# EAGLE board PolyDAC2 (EAGLE 5.11)
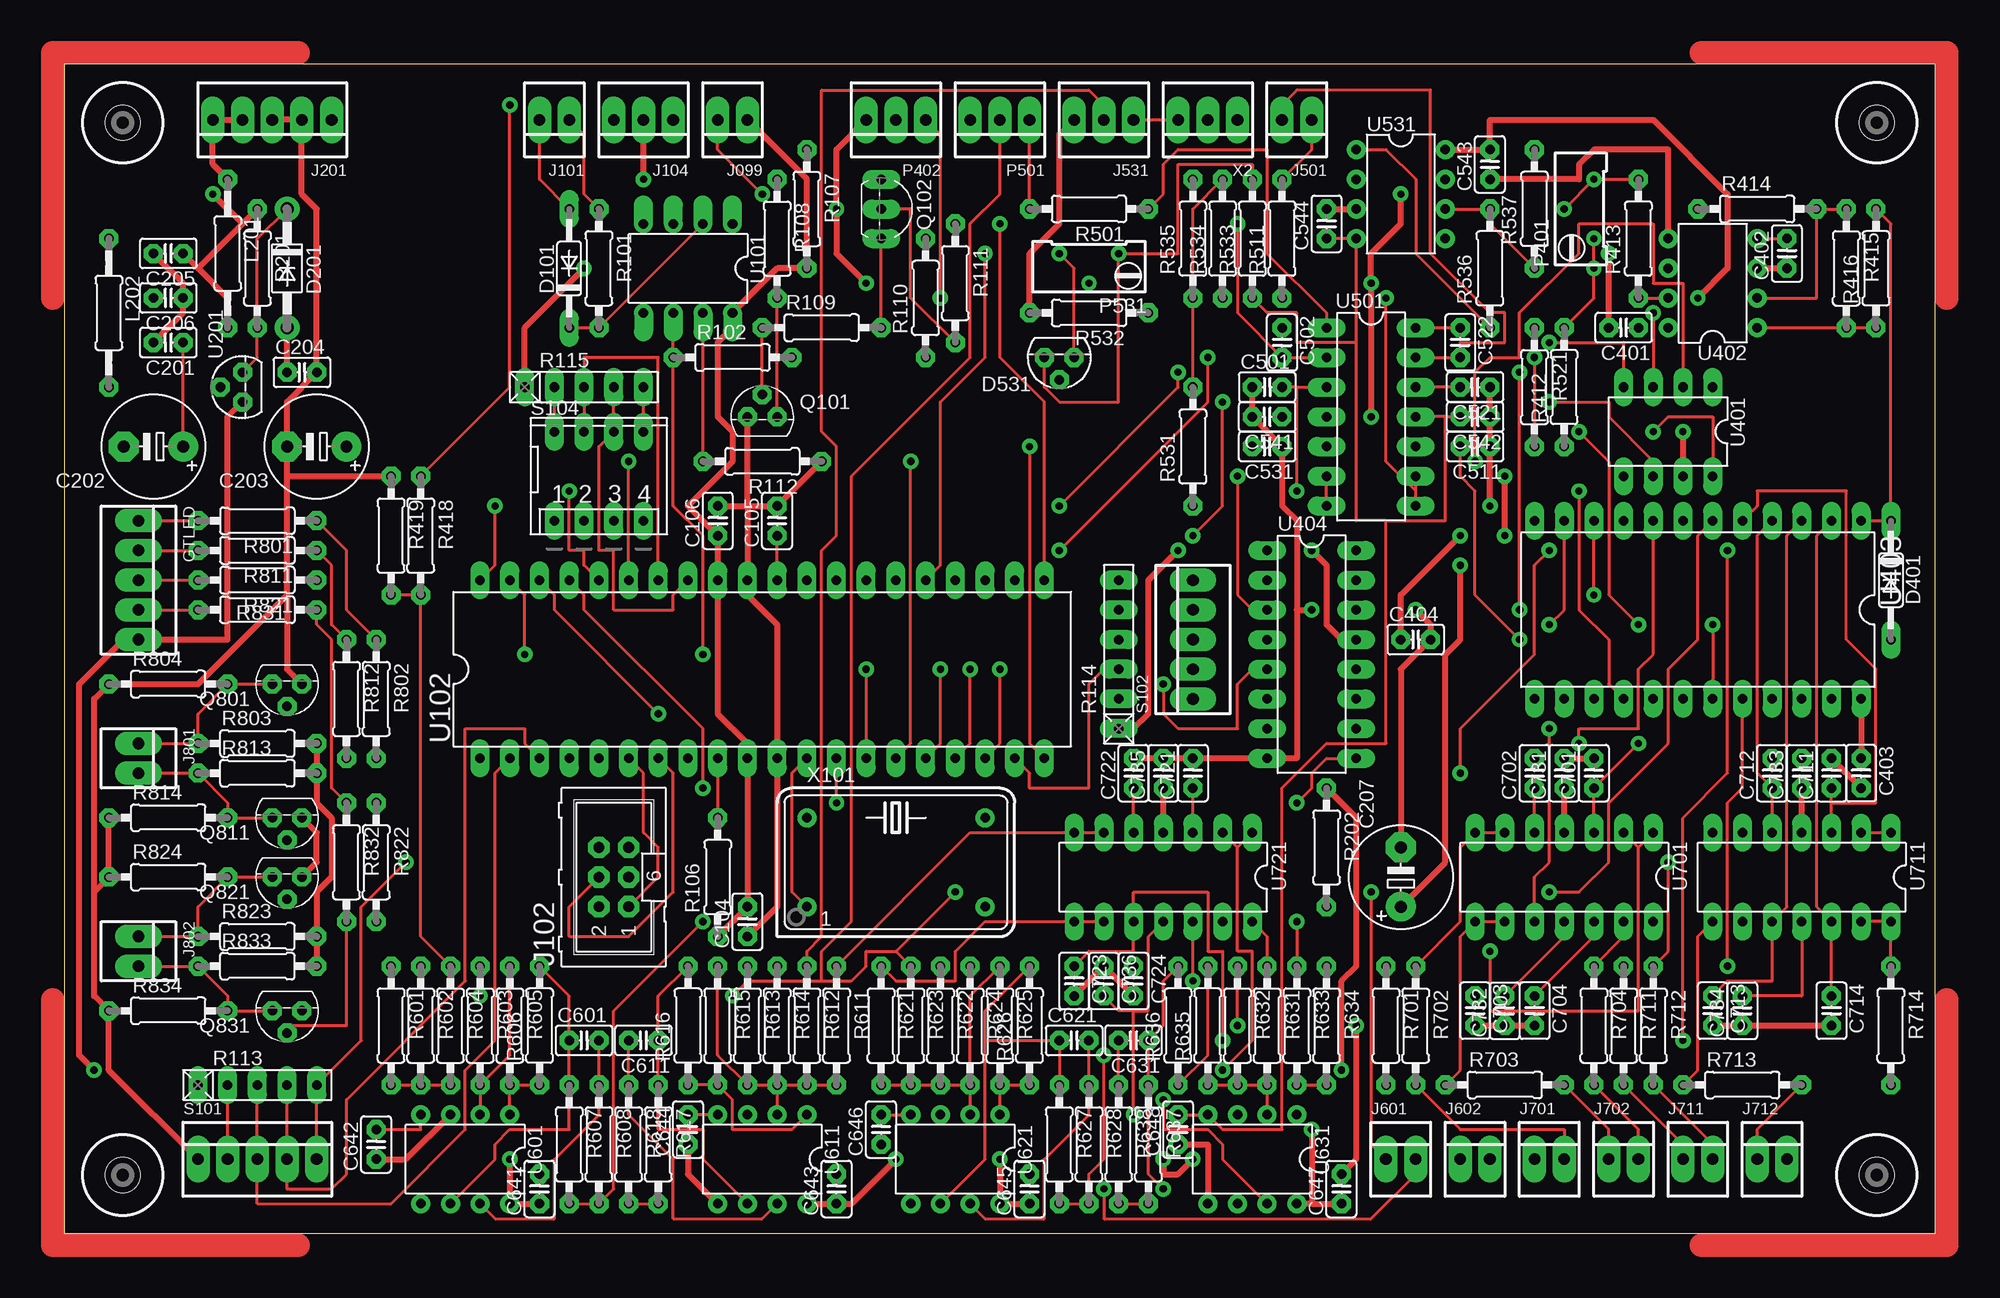
[diagram p8: board, top side]
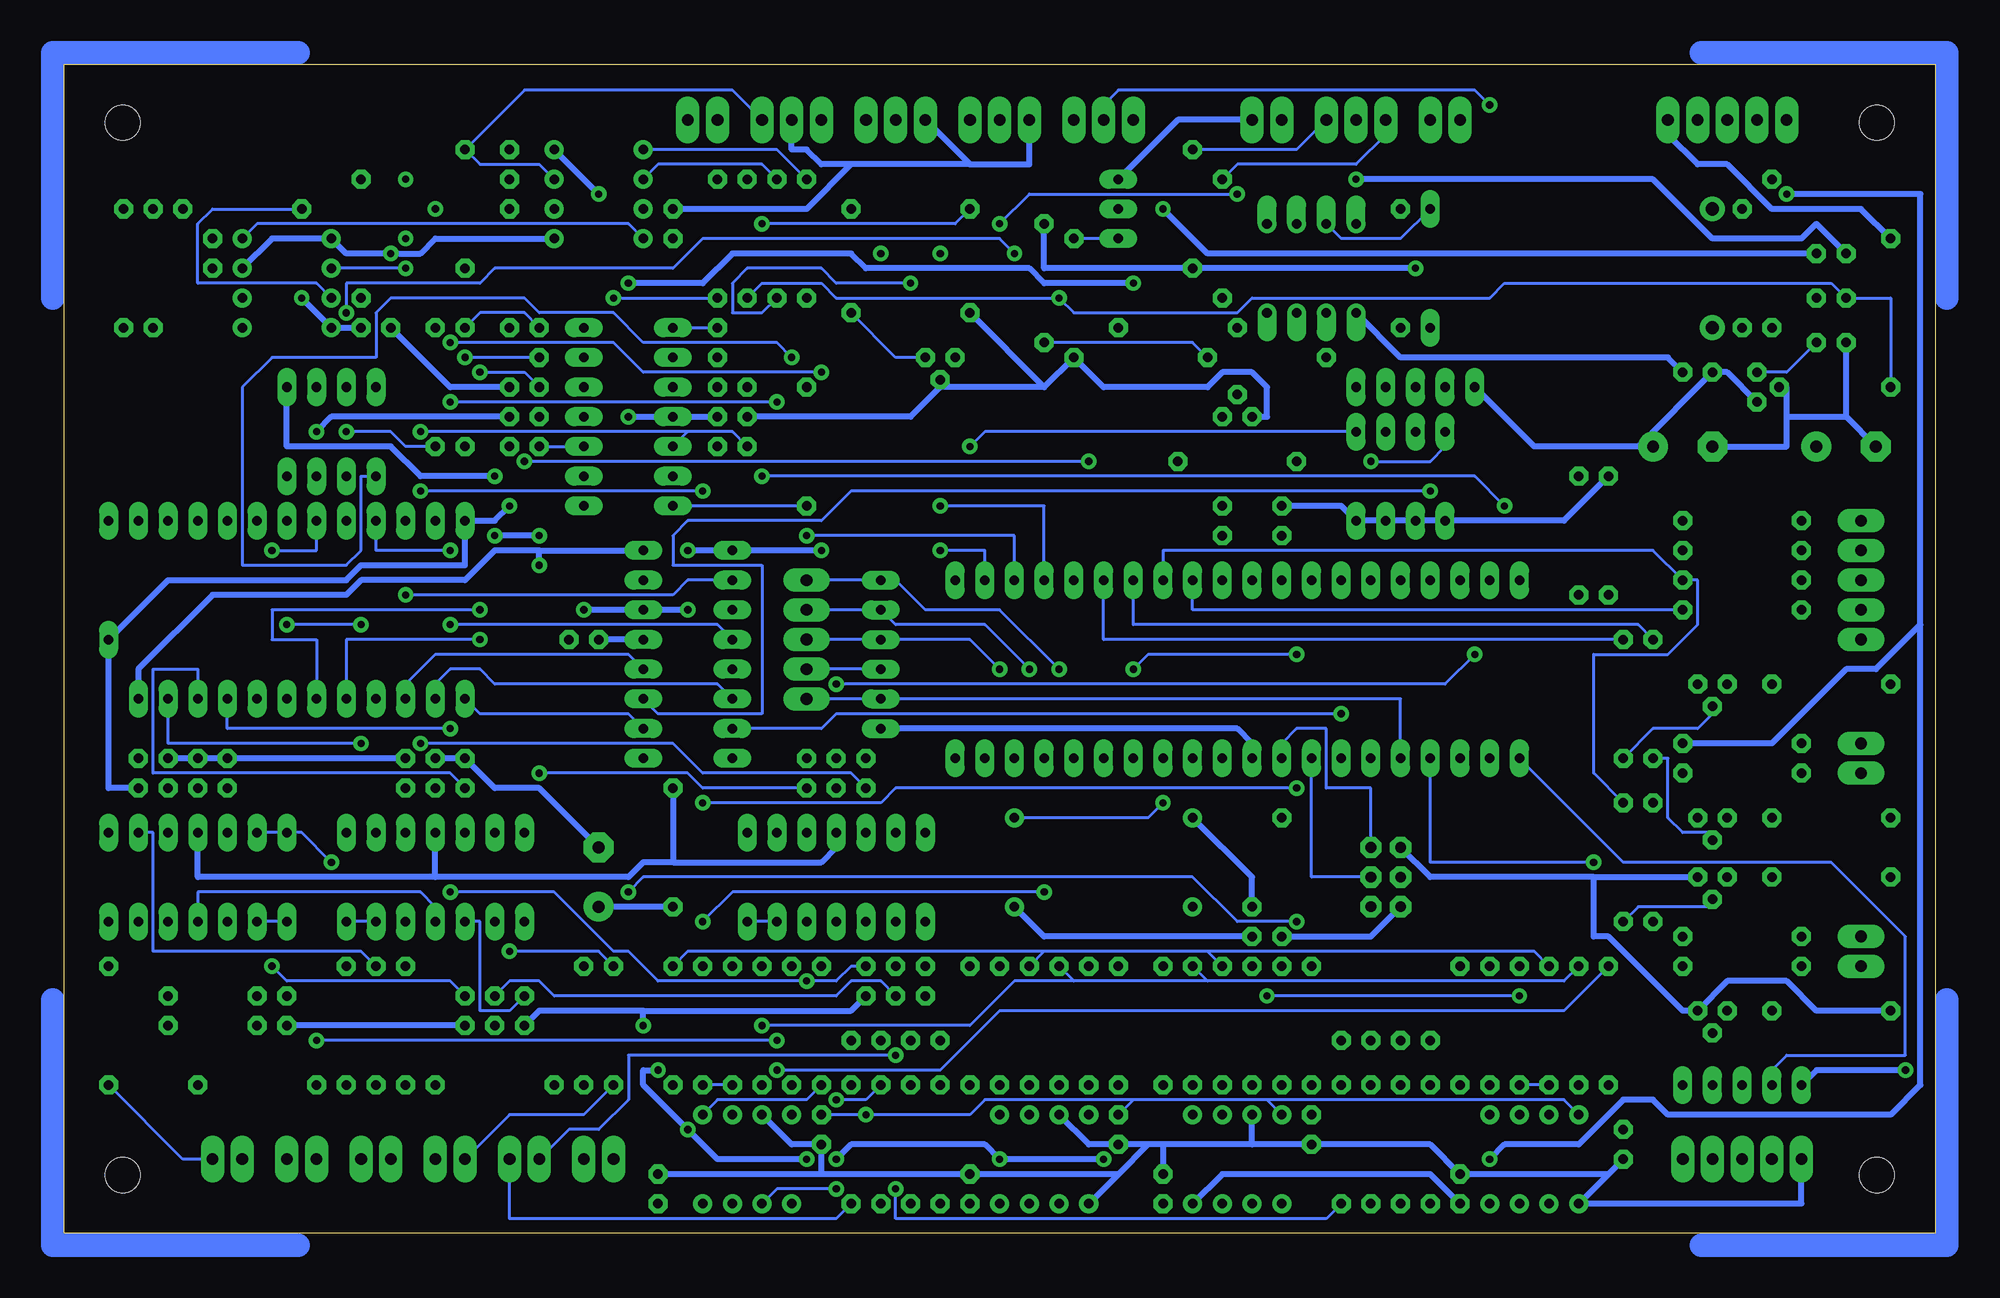
[diagram p9: board, bottom side, seen from below]

Size 160 x 100 mm. Coordinates in mm from the lower left corner, seen from the top.
Outline: 0,0 160,0 160,100 0,100 0,0
Copper layers (1*16): Top 0.035mm / dielectric 1.5mm / Bottom 0.035mm
Design rules "default *": minimum track width 10mil, minimum drill 24mil, track to track 12mil, track to pad 12mil, pad to pad 12mil, via to via 12mil, smd to smd 8mil, copper to edge 40mil, drill to drill 8mil, minimum pad ring 14mil, minimum via ring 14mil, stop-mask expansion 4mil, vias tented up to drill 0mil, thermal gap 10mil
Net classes: 1 bold: width 0.508 mm

## Footprints (pad centres in the part's own frame; a part is rotated, then mirrored left to right if it is on the bottom)
C025-025X050 = drill 0.813 octagon: 1 -1.27,0; 2 1.27,0
E5-8,5 = drill 1.016 pad 2.54 round: + -2.54,0 | drill 1.016 pad 2.54 octagon: - 2.54,0
DO35-10 = drill 0.813 long: A 5.08,0; C -5.08,0
DO41-10 = drill 1.118 round: A 5.08,0; C -5.08,0
TO92 = drill 0.813 octagon: 1 -1.27,0; 2 0,1.905; 3 1.27,0
22-23-2051 = drill 1 long: 1 -5.08,0; 2 -2.54,0; 3 0,0; 4 2.54,0; 5 5.08,0
22-23-2021 = drill 1 long: 1 -1.27,0; 2 1.27,0
ML6 = drill 0.914 octagon: 1 -2.54,-1.27; 2 -2.54,1.27; 3 0,-1.27; 4 0,1.27; 5 2.54,-1.27; 6 2.54,1.27
22-23-2031 = drill 1 long: 1 -2.54,0; 2 0,0; 3 2.54,0
0207/12 = drill 0.813 octagon: 1 -6.35,0; 2 6.35,0
RTRIM64Y = drill 0.61 round: 1 0,-2.54; 2 -2.54,0; 3 0,2.54
TO92' = drill 0.813 octagon: 1 1.27,0; 2 0,1.905; 3 -1.27,0
TO92-EBC = drill 0.813 long: B 0,-1.27; C 2.54,-1.27; E -2.54,-1.27
0207/10 = drill 0.813 octagon: 1 -5.08,0; 2 5.08,0
RN-5 = drill 0.813 long: 1 -5.08,0; 2 -2.54,0; 3 0,0; 4 2.54,0; 5 5.08,0
RN-6 = drill 0.813 long: 1 -6.35,0; 2 -3.81,0; 3 -1.27,0; 4 1.27,0; 5 3.81,0; 6 6.35,0
DP-04 = drill 0.813 long: 1 -3.81,-3.81; 2 -1.27,-3.81; 3 1.27,-3.81; 4 3.81,-3.81; 5 3.81,3.81; 6 1.27,3.81; 7 -1.27,3.81; 8 -3.81,3.81
DIL08 = drill 0.813 offset: 1 -3.81,-3.81; 2 -1.27,-3.81; 3 1.27,-3.81; 4 3.81,-3.81; 5 3.81,3.81; 6 1.27,3.81; 7 -1.27,3.81; 8 -3.81,3.81
DIL40 = drill 0.813 long: 1 -24.13,-7.62; 2 -21.59,-7.62; 3 -19.05,-7.62; 4 -16.51,-7.62; 5 -13.97,-7.62; 6 -11.43,-7.62; 7 -8.89,-7.62; 8 -6.35,-7.62; 9 -3.81,-7.62; 10 -1.27,-7.62; 11 1.27,-7.62; 12 3.81,-7.62; 13 6.35,-7.62; 14 8.89,-7.62; 15 11.43,-7.62; 16 13.97,-7.62; 17 16.51,-7.62; 18 19.05,-7.62; 19 21.59,-7.62; 20 24.13,-7.62; 21 24.13,7.62; 22 21.59,7.62; 23 19.05,7.62; 24 16.51,7.62; 25 13.97,7.62; 26 11.43,7.62; 27 8.89,7.62; 28 6.35,7.62; 29 3.81,7.62; 30 1.27,7.62; 31 -1.27,7.62; 32 -3.81,7.62; 33 -6.35,7.62; 34 -8.89,7.62; 35 -11.43,7.62; 36 -13.97,7.62; 37 -16.51,7.62; 38 -19.05,7.62; 39 -21.59,7.62; 40 -24.13,7.62
DIL08' = drill 0.813 long: 1 -3.81,-3.81; 2 -1.27,-3.81; 3 1.27,-3.81; 4 3.81,-3.81; 5 3.81,3.81; 6 1.27,3.81; 7 -1.27,3.81; 8 -3.81,3.81
DIL08'' = drill 0.813 pad 1.27 round: 1 -3.81,-3.81; 2 -1.27,-3.81; 3 1.27,-3.81; 4 3.81,-3.81; 5 3.81,3.81; 6 1.27,3.81; 7 -1.27,3.81; 8 -3.81,3.81
DIL24-6 = drill 0.813 long: 1 -13.97,-7.62; 2 -11.43,-7.62; 3 -8.89,-7.62; 4 -6.35,-7.62; 5 -3.81,-7.62; 6 -1.27,-7.62; 7 1.27,-7.62; 8 3.81,-7.62; 9 6.35,-7.62; 10 8.89,-7.62; 11 11.43,-7.62; 12 13.97,-7.62; 13 13.97,7.62; 14 11.43,7.62; 15 8.89,7.62; 16 6.35,7.62; 17 3.81,7.62; 18 1.27,7.62; 19 -1.27,7.62; 20 -3.81,7.62; 21 -6.35,7.62; 22 -8.89,7.62; 23 -11.43,7.62; 24 -13.97,7.62
DIL16 = drill 0.813 long: 1 -8.89,-3.81; 2 -6.35,-3.81; 3 -3.81,-3.81; 4 -1.27,-3.81; 5 1.27,-3.81; 6 3.81,-3.81; 7 6.35,-3.81; 8 8.89,-3.81; 9 8.89,3.81; 10 6.35,3.81; 11 3.81,3.81; 12 1.27,3.81; 13 -1.27,3.81; 14 -3.81,3.81; 15 -6.35,3.81; 16 -8.89,3.81
DIL14 = drill 0.813 long: 1 -7.62,-3.81; 2 -5.08,-3.81; 3 -2.54,-3.81; 4 0,-3.81; 5 2.54,-3.81; 6 5.08,-3.81; 7 7.62,-3.81; 8 7.62,3.81; 9 5.08,3.81; 10 2.54,3.81; 11 0,3.81; 12 -2.54,3.81; 13 -5.08,3.81; 14 -7.62,3.81
DRIL-3 = hole 3: 0,0
DIL14S = drill 0.813 round: 1 -7.62,-3.81; 7 7.62,-3.81; 8 7.62,3.81; 14 -7.62,3.81

## Placement (x,y rotation side)
C104  100nF  [C025-025X050]  58.42,26.67 90 top
C105  100nF  [C025-025X050]  60.96,60.96 90 top
C106  100nF  [C025-025X050]  55.88,60.96 90 top
C201  100nF  [C025-025X050]  8.89,76.2 180 top
C202  22µ 25V  [E5-8,5]  7.62,67.31 180 top
C203  22µ 25V  [E5-8,5]  21.59,67.31 180 top
C204  100nF  [C025-025X050]  20.32,73.66 0 top
C205  100nF  [C025-025X050]  8.89,83.82 180 top
C206  100nF  [C025-025X050]  8.89,80.01 180 top
C207  22µ 25V  [E5-8,5]  114.3,30.48 90 top
C401  100nF  [C025-025X050]  133.35,77.47 180 top
C402  100nF  [C025-025X050]  147.32,83.82 90 top
C403  100nF  [C025-025X050]  153.67,39.37 270 top
C404  100nF  [C025-025X050]  115.57,50.8 0 top
C501  10nF  [C025-025X050]  102.87,72.39 0 top
C502  33pF  [C025-025X050]  104.14,76.2 270 top
C511  10nF  [C025-025X050]  120.65,67.31 180 top
C521  10nF  [C025-025X050]  120.65,72.39 180 top
C522  33pF  [C025-025X050]  119.38,76.2 270 top
C531  10nF  [C025-025X050]  102.87,67.31 180 top
C541  100nF  [C025-025X050]  102.87,69.85 180 top
C542  100nF  [C025-025X050]  120.65,69.85 180 top
C543  100nF  [C025-025X050]  121.92,91.44 90 top
C544  100nF  [C025-025X050]  107.95,86.36 90 top
C601  33pF  [C025-025X050]  44.45,16.51 0 top
C611  33pF  [C025-025X050]  49.53,16.51 180 top
C621  33pF  [C025-025X050]  86.36,16.51 0 top
C631  33pF  [C025-025X050]  91.44,16.51 180 top
C641  100nF  [C025-025X050]  40.64,3.81 90 top
C642  100nF  [C025-025X050]  26.67,7.62 90 top
C643  100nF  [C025-025X050]  66.04,3.81 90 top
C644  100nF  [C025-025X050]  53.34,8.89 90 top
C645  100nF  [C025-025X050]  82.55,3.81 90 top
C646  100nF  [C025-025X050]  69.85,8.89 90 top
C647  100nF  [C025-025X050]  109.22,3.81 90 top
C648  100nF  [C025-025X050]  95.25,8.89 90 top
C701  10nF  [C025-025X050]  130.81,39.37 90 top
C702  10nF  [C025-025X050]  125.73,39.37 90 top
C703  10nF  [C025-025X050]  120.65,19.05 270 top
C704  10nF  [C025-025X050]  125.73,19.05 270 top
C711  10nF  [C025-025X050]  151.13,39.37 90 top
C712  10nF  [C025-025X050]  146.05,39.37 90 top
C713  10nF  [C025-025X050]  140.97,19.05 270 top
C714  10nF  [C025-025X050]  151.13,19.05 270 top
C721  10nF  [C025-025X050]  96.52,39.37 90 top
C722  10nF  [C025-025X050]  91.44,39.37 90 top
C723  10nF  [C025-025X050]  86.36,21.59 270 top
C724  10nF  [C025-025X050]  91.44,21.59 270 top
C731  100nF  [C025-025X050]  128.27,39.37 90 top
C732  100nF  [C025-025X050]  123.19,19.05 90 top
C733  100nF  [C025-025X050]  148.59,39.37 90 top
C734  100nF  [C025-025X050]  143.51,19.05 90 top
C735  100nF  [C025-025X050]  93.98,39.37 90 top
C736  100nF  [C025-025X050]  88.9,21.59 270 top
D101  1N4148  [DO35-10]  43.18,82.55 90 top
D201  1N4004  [DO41-10]  19.05,82.55 270 top
D401  BAT42  [DO35-10]  156.21,55.88 270 top
D531  LM336LP  [TO92]  85.09,74.93 180 top
GTLED  GATELED  [22-23-2051]  6.35,55.88 270 top
J099  MIDI-LED  [22-23-2021]  57.15,95.25 180 top
J101  MIDI-IN  [22-23-2021]  41.91,95.25 180 top
J102  ISP  [ML6]  46.99,30.48 90 top
J104  MIDI-THRU  [22-23-2031]  49.53,95.25 180 top
J201  POWER IN  [22-23-2051]  17.78,95.25 180 top
J501  SUSTAIN AFTERTOUCH  [22-23-2021]  105.41,95.25 180 top
J531  PITCH CV  [22-23-2031]  88.9,95.25 180 top
J601  NOTE 0/1  [22-23-2021]  114.3,6.35 0 top
J602  NOTE 2/3  [22-23-2021]  120.65,6.35 0 top
J701  CC 1/2  [22-23-2021]  127,6.35 0 top
J702  CC 3/4  [22-23-2021]  133.35,6.35 0 top
J711  VELO 0/1  [22-23-2021]  139.7,6.35 0 top
J712  VELO 3/4  [22-23-2021]  146.05,6.35 0 top
J801  GATE 1/2  [22-23-2021]  6.35,40.64 270 top
J802  GATE 3/4  [22-23-2021]  6.35,24.13 270 top
L201  1mH  [0207/12]  13.97,83.82 270 top
L202  1mH  [0207/12]  3.81,78.74 270 top
P401  2K 25T  [RTRIM64Y]  130.81,87.63 0 top
P402  TUNE  [22-23-2031]  71.12,95.25 180 top
P501  MODWHEEL/PITCH  [22-23-2031]  80.01,95.25 180 top
P531  10K 25T  [RTRIM64Y]  87.63,83.82 90 top
Q101  2N3904  [TO92']  59.69,69.85 0 top
Q102  2N3906  [TO92-EBC]  71.12,87.63 270 top
Q801  2N3904  [TO92']  19.05,46.99 180 top
Q811  2N3904  [TO92']  19.05,35.56 180 top
Q821  2N3904  [TO92']  19.05,30.48 180 top
Q831  2N3904  [TO92']  19.05,19.05 180 top
R101  220R  [0207/10]  45.72,82.55 270 top
R102  1K5  [0207/10]  57.15,74.93 0 top
R106  10K  [0207/10]  55.88,30.48 90 top
R107  220R  [0207/10]  63.5,87.63 270 top
R108  220R  [0207/10]  60.96,85.09 270 top
R109  4K7  [0207/10]  64.77,77.47 0 top
R110  33K  [0207/10]  73.66,80.01 90 top
R111  220R  [0207/10]  76.2,81.28 270 top
R112  15K  [0207/10]  59.69,66.04 180 top
R113  4x 1K  [RN-5]  16.51,12.7 0 top
R114  5 x 1K  [RN-6]  90.17,49.53 90 top
R115  4 x 1K  [RN-5]  44.45,72.39 0 top
R201  56R  [0207/10]  16.51,82.55 270 top
R202  100R  [0207/10]  107.95,33.02 270 top
R412  4K7  [0207/10]  128.27,72.39 90 top
R413  11K5  [0207/10]  134.62,85.09 90 top
R414  11K  [0207/10]  144.78,87.63 0 top
R415  22K  [0207/10]  152.4,82.55 270 top
R416  10R  [0207/10]  154.94,82.55 90 top
R418  10k  [0207/10]  30.48,59.69 270 top
R419  1k  [0207/10]  27.94,59.69 270 top
R501  75R  [0207/10]  87.63,87.63 180 top
R511  75R  [0207/10]  104.14,85.09 90 top
R521  75R  [0207/10]  125.73,72.39 270 top
R531  47K  [0207/10]  96.52,67.31 90 top
R532  4K7  [0207/10]  87.63,78.74 180 top
R533  3K3  [0207/10]  101.6,85.09 90 top
R534  47K  [0207/10]  99.06,85.09 90 top
R535  47K  [0207/10]  96.52,85.09 90 top
R536  47K  [0207/10]  121.92,82.55 90 top
R537  10K  [0207/10]  125.73,87.63 90 top
R601  10K  [0207/10]  27.94,17.78 270 top
R602  10K  [0207/10]  30.48,17.78 270 top
R603  10K  [0207/10]  35.56,17.78 270 top
R604  10K  [0207/10]  33.02,17.78 270 top
R605  10K  [0207/10]  38.1,17.78 270 top
R606  10K  [0207/10]  40.64,17.78 90 top
R607  10K  [0207/10]  43.18,7.62 270 top
R608  75R  [0207/10]  45.72,7.62 270 top
R611  10K  [0207/10]  66.04,17.78 270 top
R612  10K  [0207/10]  63.5,17.78 270 top
R613  10K  [0207/10]  58.42,17.78 270 top
R614  10K  [0207/10]  60.96,17.78 270 top
R615  10K  [0207/10]  55.88,17.78 270 top
R616  10K  [0207/10]  53.34,17.78 90 top
R617  10K  [0207/10]  50.8,7.62 270 top
R618  75R  [0207/10]  48.26,7.62 270 top
R621  10K  [0207/10]  69.85,17.78 270 top
R622  10K  [0207/10]  74.93,17.78 270 top
R623  10K  [0207/10]  72.39,17.78 270 top
R624  10K  [0207/10]  77.47,17.78 270 top
R625  10K  [0207/10]  80.01,17.78 270 top
R626  10K  [0207/10]  82.55,17.78 90 top
R627  10K  [0207/10]  85.09,7.62 270 top
R628  75R  [0207/10]  87.63,7.62 270 top
R631  10K  [0207/10]  102.87,17.78 270 top
R632  10K  [0207/10]  100.33,17.78 270 top
R633  10K  [0207/10]  105.41,17.78 270 top
R634  10K  [0207/10]  107.95,17.78 270 top
R635  10K  [0207/10]  97.79,17.78 90 top
R636  10K  [0207/10]  95.25,17.78 90 top
R637  10K  [0207/10]  92.71,7.62 270 top
R638  75R  [0207/10]  90.17,7.62 270 top
R701  75R  [0207/10]  113.03,17.78 270 top
R702  75R  [0207/10]  115.57,17.78 270 top
R703  75R  [0207/10]  123.19,12.7 0 top
R704  75R  [0207/10]  130.81,17.78 270 top
R711  75R  [0207/10]  133.35,17.78 270 top
R712  75R  [0207/10]  135.89,17.78 270 top
R713  75R  [0207/10]  143.51,12.7 0 top
R714  75R  [0207/10]  156.21,17.78 270 top
R801  1K  [0207/10]  16.51,60.96 180 top
R802  3K3  [0207/10]  26.67,45.72 270 top
R803  10K  [0207/10]  16.51,41.91 0 top
R804  10K  [0207/10]  8.89,46.99 0 top
R811  1K  [0207/10]  16.51,58.42 180 top
R812  3K3  [0207/10]  24.13,45.72 270 top
R813  10K  [0207/10]  16.51,39.37 0 top
R814  10K  [0207/10]  8.89,35.56 0 top
R821  1K  [0207/10]  16.51,55.88 180 top
R822  3K3  [0207/10]  26.67,31.75 270 top
R823  10K  [0207/10]  16.51,25.4 0 top
R824  10K  [0207/10]  8.89,30.48 0 top
R831  1K  [0207/10]  16.51,53.34 180 top
R832  3K3  [0207/10]  24.13,31.75 270 top
R833  10K  [0207/10]  16.51,22.86 0 top
R834  10K  [0207/10]  8.89,19.05 0 top
S101  MIDI ADDRESS  [22-23-2051]  16.51,6.35 0 top
S102  OPTIONS  [22-23-2051]  96.52,50.8 90 top
S104  DIPSW4  [DP-04]  45.72,64.77 0 top
U101  6N138  [DIL08]  53.34,82.55 180 top
U102  MEGA16-P  [DIL40]  59.69,48.26 0 top
U201  7805L  [TO92]  15.24,72.39 90 top
U401  AD8300  [DIL08']  137.16,68.58 180 top
U402  AD712N  [DIL08'']  140.97,81.28 90 top
U403  4067N  [DIL24-6]  139.7,53.34 180 top
U404  4504N  [DIL16]  106.68,49.53 270 top
U501  TL074P  [DIL14]  111.76,69.85 270 top
U531  LF412N  [DIL08'']  114.3,88.9 270 top
U601  LF412N  [DIL08'']  34.29,6.35 180 top
U611  LF412N  [DIL08'']  59.69,6.35 180 top
U621  LF412N  [DIL08'']  76.2,6.35 180 top
U631  LF412N  [DIL08'']  101.6,6.35 180 top
U701  TL074P  [DIL14]  128.27,30.48 180 top
U711  TL074P  [DIL14]  148.59,30.48 180 top
U721  TL074P  [DIL14]  93.98,30.48 180 top
U$1  [DRIL-3]  5,5 0 top
U$2  [DRIL-3]  155,5 0 top
U$3  [DRIL-3]  5,95 0 top
U$4  [DRIL-3]  155,95 0 top
X2  BEND RANGE  [22-23-2031]  97.79,95.25 180 top
X101  16 MHZ  [DIL14S]  71.12,31.75 0 top

## Tracks (layer width: path | path; a pad name or v marks a point on that pad's centre or on a via)
+5V  (via drill 0.61)
  Top 0.508: v106.68,58.42 107.95,57.15 107.95,52.07 109.22,50.8 U404.13 | v123.19,59.69 v123.19,64.77 | v119.38,59.69 114.3,54.61 C404.1 | R106.1 C104.2 U102.10 58.42,41.91 55.88,44.45 U102.32 C106.1 53.34,62.23 57.15,66.04 57.15,68.58 55.88,69.85 55.88,76.2 57.15,77.47 U101.8 60.96,82.55 R107.2 63.5,90.17 J099.1 | v95.25,58.42 92.71,55.88 92.71,44.45 91.44,43.18 R114.1 | v2.54,13.97 1.27,15.24 1.27,46.99 5.08,50.8 GTLED.5 13.97,50.8 13.97,69.85 U201.1 | C204.1 D201.A | v44.45,82.55 39.37,77.47 R115.1
  Bottom 0.508: U404.13 C404.1 | v106.68,58.42 U404.1 v95.25,58.42 | U401.1 140.97,67.31 132.08,67.31 129.54,64.77 v123.19,64.77 | v119.38,59.69 v123.19,59.69 | X101.14 58.42,30.48 C104.2 | R114.1 59.69,43.18 58.42,41.91 U102.10 | J102.2 48.26,25.4 R106.1 | R113.1 10.16,13.97 v2.54,13.97 | Q102.E 64.77,95.25 J099.1 | R111.1 76.2,82.55 R107.2 v44.45,82.55 | U201.1 17.78,73.66 C204.1 25.4,67.31 | R115.1 34.29,67.31 25.4,67.31 | 25.4,67.31 C203.+
+15V  (via drill 0.61)
  Top 0.508: U711.4 C733.1 | U701.4 C731.1 | 106.68,2.54 C647.1 | 106.68,2.54 U631.8 | U721.4 C735.1 | v106.68,8.89 106.68,2.54 | v109.22,13.97 109.22,21.59 110.49,22.86 110.49,35.56 R202.1 | U531.8 C543.2 121.92,95.25 135.89,95.25 142.24,88.9 142.24,82.55 v139.7,80.01 | v111.76,69.85 v111.76,81.28 111.76,83.82 114.3,86.36 v114.3,88.9 | C645.1 U621.8 v80.01,6.35 | C641.1 U601.8 v38.1,6.35 | U611.8 C643.1 67.31,2.54 v71.12,6.35 | R833.2 R823.2 21.59,29.21 22.86,30.48 22.86,35.56 21.59,36.83 R813.2 R803.2 | 11.43,82.55 13.97,80.01 L201.2 | 11.43,82.55 C205.1 | 15.24,86.36 11.43,82.55 | 15.24,86.36 R201.1 | P402.3 66.04,92.71 v66.04,87.63 66.04,83.82 v68.58,81.28 | v12.7,88.9 15.24,86.36 | v96.52,6.35 95.25,5.08 93.98,5.08 v93.98,6.35
  Bottom 0.508: R202.1 107.95,31.75 | 107.95,31.75 95.25,31.75 93.98,33.02 U721.4 | v109.22,13.97 110.49,13.97 110.49,12.7 v106.68,8.89 104.14,6.35 v96.52,6.35 | 128.27,30.48 U701.4 | 128.27,30.48 111.76,30.48 110.49,31.75 107.95,31.75 | U711.4 148.59,30.48 128.27,30.48 | C541.1 U501.4 v111.76,69.85 | C401.1 U402.8 v139.7,80.01 | v114.3,88.9 U531.8 | C641.1 43.18,5.08 60.96,5.08 U611.8 | v71.12,6.35 v80.01,6.35 81.28,7.62 92.71,7.62 v93.98,6.35 | v66.04,87.63 62.23,83.82 C205.1 | R803.2 13.97,41.91 7.62,48.26 5.08,48.26 1.27,52.07 | 1.27,52.07 1.27,88.9 v12.7,88.9 | v38.1,6.35 36.83,7.62 30.48,7.62 26.67,11.43 24.13,11.43 22.86,10.16 3.81,10.16 1.27,12.7 1.27,52.07 | v111.76,81.28 105.41,81.28 102.87,83.82 92.71,83.82 91.44,82.55 77.47,82.55 76.2,81.28 v68.58,81.28
+15VF  (via drill 0.61)
  Top 0.508: U403.24 C403.1 | C207.+ 118.11,31.75 118.11,49.53 119.38,50.8 v119.38,57.15
  Bottom 0.508: R202.2 C207.+ | 119.38,58.42 123.19,58.42 125.73,55.88 134.62,55.88 135.89,54.61 147.32,54.61 153.67,48.26 U403.24 | 119.38,58.42 U404.16 | v119.38,57.15 119.38,58.42
-15V  (via drill 0.61)
  Top 0.254: C734.2 148.59,20.32 U711.11 | C736.2 90.17,19.05 91.44,19.05 | 91.44,19.05 92.71,19.05 92.71,25.4 U721.11 | C732.2 128.27,25.4 U701.11 | C642.2 30.48,8.89 U601.4 | C648.2 U631.4 99.06,8.89 104.14,8.89 104.14,38.1 107.95,41.91 113.03,41.91 113.03,60.96 | U611.4 C644.2 | C646.2 U621.4 | v91.44,10.16 91.44,19.05 | 118.11,69.85 C542.2 | 118.11,69.85 U501.11 | U402.4 C402.2 | R533.1 102.87,78.74 105.41,78.74 105.41,76.2 110.49,76.2 | 110.49,76.2 U531.4 C544.1 | P402.1 74.93,93.98 v74.93,80.01 | 118.11,69.85 118.11,60.96 113.03,60.96 | 113.03,60.96 110.49,60.96 110.49,76.2
  Bottom 0.254: C736.2 90.17,21.59 92.71,21.59 93.98,20.32 118.11,20.32 119.38,21.59 121.92,21.59 C732.2 | U711.11 148.59,29.21 129.54,29.21 128.27,27.94 U701.11 | 57.15,11.43 U611.4 | 57.15,11.43 68.58,11.43 | 68.58,11.43 C646.2 | C648.2 v91.44,10.16 82.55,10.16 81.28,11.43 68.58,11.43 | U601.4 31.75,11.43 57.15,11.43 | L202.2 3.81,80.01 C206.2 8.89,81.28 36.83,81.28 38.1,80.01 58.42,80.01 59.69,78.74 73.66,78.74 v74.93,80.01 93.98,80.01 95.25,81.28 100.33,81.28 R533.1 | U402.4 143.51,86.36 111.76,86.36 U531.4
CC_0  (via drill 0.61)
  Top 0.254: U701.3 C701.1 v134.62,41.91
  Bottom 0.254: U403.23 151.13,41.91 v134.62,41.91
CC_1
  Top 0.254: U701.5 C702.1
  Bottom 0.254: U403.22 148.59,48.26 152.4,48.26 152.4,39.37 127,39.37 C702.1
CC_2  (via drill 0.61)
  Top 0.254: v127,43.18 127,31.75 125.73,30.48 U701.10
  Bottom 0.254: C703.1 121.92,19.05 124.46,19.05 124.46,26.67 U701.10 | U403.21 146.05,43.18 v127,43.18
CC_3  (via drill 0.61)
  Top 0.254: C704.1 130.81,25.4 U701.12 | U403.20 143.51,38.1 142.24,36.83 v142.24,22.86
  Bottom 0.254: v142.24,22.86 140.97,21.59 127,21.59 C704.1
CV_0  (via drill 0.61)
  Top 0.254: v140.97,52.07 U403.19 | v134.62,52.07 132.08,54.61 132.08,66.04 v129.54,68.58
  Bottom 0.254: C531.2 102.87,68.58 106.68,68.58 | 106.68,68.58 U501.5 | v134.62,52.07 v140.97,52.07 | 106.68,68.58 v129.54,68.58
CV_1  (via drill 0.61)
  Top 0.254: C521.2 U501.12 | v124.46,53.34 v124.46,73.66
  Bottom 0.254: U403.18 138.43,50.8 142.24,50.8 142.24,53.34 v124.46,53.34 | v124.46,73.66 120.65,73.66 C521.2
CV_2  (via drill 0.61)
  Top 0.254: v124.46,50.8 120.65,54.61 120.65,63.5 119.38,64.77 C511.2
  Bottom 0.254: C511.2 U501.10 | U403.17 135.89,50.8 v124.46,50.8
CV_3  (via drill 0.61)
  Top 0.254: 105.41,72.39 U501.3 | 105.41,72.39 C501.2 | U403.16 132.08,46.99 132.08,50.8 129.54,53.34 v129.54,63.5 | v105.41,63.5 105.41,72.39
  Bottom 0.254: v105.41,63.5 v129.54,63.5
GATE-LED1
  Top 0.254: GTLED.1 R801.2
GATE-LED2
  Top 0.254: GTLED.2 R811.2
GATE-LED3
  Top 0.254: GTLED.3 R821.2
GATE-LED4
  Top 0.254: GTLED.4 R831.2
GATEOUT1
  Top 0.254: Q801.1 R804.2 11.43,44.45 R803.1 J801.1
GATEOUT2
  Top 0.254: Q811.1 R814.2 13.97,36.83 R813.1 J801.2
GATEOUT3
  Top 0.254: Q821.1 R824.2 11.43,27.94 R823.1 J802.1
GATEOUT4
  Top 0.254: Q831.1 R834.2 13.97,20.32 R833.1 J802.2
GND  (via drill 0.61)
  Top 0.508: Q821.3 21.59,31.75 21.59,34.29 Q811.3 | 2.54,29.21 2.54,20.32 R834.1 3.81,13.97 S101.1 | 2.54,29.21 R824.1 R814.1 | 2.54,29.21 2.54,45.72 R804.1 11.43,46.99 19.05,54.61 | C723.2 C736.1 C724.2 | C703.2 C732.1 C704.2 | C713.2 C734.1 C714.2 | U601.3 29.21,6.35 C642.1 | C648.1 97.79,7.62 U631.5 | U611.5 53.34,5.08 C644.1 | v110.49,17.78 110.49,6.35 C647.2 | C521.1 C542.1 C511.1 v121.92,62.23 | v138.43,68.58 U401.7 | U402.3 C402.1 | C543.1 129.54,90.17 129.54,91.44 130.81,92.71 137.16,92.71 U402.5 | C401.2 v132.08,83.82 | C207.- 114.3,48.26 C404.2 116.84,52.07 v115.57,53.34 | C731.2 C701.2 | C711.2 C403.2 | C544.2 U531.3 | C722.2 C735.2 C721.2 U404.8 105.41,40.64 105.41,53.34 | C501.1 C541.2 C531.1 104.14,62.23 105.41,60.96 105.41,53.34 | J531.3 85.09,93.98 85.09,86.36 82.55,83.82 R532.2 | C104.1 60.96,27.94 U102.11 60.96,52.07 58.42,54.61 U102.31 58.42,62.23 | 58.42,62.23 C105.2 R112.1 | C106.2 58.42,62.23 | 58.42,62.23 Q101.3 | C201.2 10.16,78.74 C206.1 10.16,81.28 C205.2 | v49.53,90.17 J104.2 | J201.3 J201.2 20.32,88.9 21.59,87.63 C204.2 19.05,71.12 C203.- 19.05,64.77 | Q801.3 19.05,48.26 19.05,54.61 | 19.05,54.61 19.05,64.77 | 19.05,64.77 R419.1 | 105.41,53.34 v106.68,53.34
  Bottom 0.508: J102.6 43.18,30.48 29.21,30.48 | 29.21,30.48 Q821.3 | R834.1 10.16,19.05 12.7,21.59 17.78,21.59 Q831.3 21.59,19.05 27.94,25.4 29.21,25.4 29.21,30.48 | C704.2 C713.2 | C724.2 92.71,19.05 110.49,19.05 | 110.49,19.05 119.38,19.05 C703.2 | 27.94,5.08 U601.5 11.43,2.54 S101.1 | 27.94,5.08 C642.1 | 27.94,5.08 C641.2 43.18,7.62 C644.1 58.42,7.62 | U631.3 97.79,7.62 C648.1 95.25,5.08 | 67.31,7.62 C646.1 72.39,7.62 U621.3 | 66.04,7.62 67.31,7.62 | 58.42,7.62 66.04,7.62 | 58.42,7.62 U611.3 | 66.04,7.62 C643.2 | 67.31,7.62 69.85,5.08 | 69.85,5.08 U621.5 | 69.85,5.08 C645.2 95.25,5.08 | 95.25,5.08 C647.2 | v110.49,17.78 110.49,19.05 | v138.43,68.58 137.16,69.85 C542.1 | C401.2 127,72.39 C521.1 | U531.5 128.27,85.09 129.54,83.82 v132.08,83.82 135.89,83.82 U402.5 142.24,85.09 U402.3 | v115.57,53.34 U404.14 v106.68,53.34 | C731.2 C702.2 123.19,38.1 119.38,38.1 C207.- | C711.2 C733.2 C712.2 C701.2 | C403.2 156.21,38.1 D401.A 151.13,55.88 135.89,55.88 134.62,57.15 125.73,57.15 U403.12 123.19,60.96 v121.92,62.23 | P501.3 77.47,91.44 82.55,91.44 | J531.3 82.55,91.44 | X2.2 97.79,92.71 96.52,92.71 95.25,91.44 92.71,91.44 | 82.55,91.44 92.71,91.44 | C544.2 96.52,87.63 92.71,91.44 | 76.2,72.39 R110.1 71.12,72.39 62.23,72.39 60.96,73.66 58.42,73.66 57.15,72.39 57.15,69.85 Q101.3 | 76.2,72.39 85.09,72.39 | 76.2,72.39 R532.2 | C541.2 87.63,69.85 85.09,72.39 | 85.09,72.39 D531.2 | X101.7 76.2,25.4 C104.1 | C106.2 50.8,62.23 S104.4 S104.3 S104.2 S104.1 31.75,60.96 R419.1 | v49.53,90.17 24.13,90.17 19.05,85.09 11.43,85.09 10.16,86.36 C205.2 | 12.7,69.85 12.7,67.31 C203.- | 12.7,69.85 12.7,72.39 U201.2 | U101.5 45.72,74.93 22.86,74.93 C204.2
  Bottom 0.508: 7.62,69.85 C202.- | 12.7,69.85 7.62,69.85 | 7.62,69.85 C201.2
N$1  (via drill 0.61)
  Top 0.254: R418.1 38.1,72.39 v38.1,96.52
  Bottom 0.254: v38.1,96.52 39.37,97.79 69.85,97.79 71.12,96.52 P402.2
N$2  (via drill 0.61)
  Top 0.254: v130.81,54.61 U403.10
  Bottom 0.254: U404.2 106.68,55.88 107.95,54.61 v130.81,54.61
N$3  (via drill 0.61)
  Top 0.254: v127,52.07 128.27,53.34 U403.11
  Bottom 0.254: U404.4 104.14,52.07 v127,52.07
N$4
  Bottom 0.254: U404.6 104.14,46.99 123.19,46.99 124.46,48.26 127,48.26 128.27,46.99 U403.14
N$5
  Bottom 0.254: U404.10 111.76,44.45 124.46,44.45 U403.13
N$6
  Bottom 0.254: U404.12 111.76,49.53 128.27,49.53 130.81,46.99 U403.15
N$7
  Top 0.254: U403.1 D401.C 156.21,86.36 R416.2
N$8
  Top 2: 20,-1 -1,-1 -1,20
N$9
  Top 2: 140,-1 161,-1 161,20
N$10
  Top 0.254: U402.1 R415.2 R416.1
N$11
  Top 2: 20,101 -1,101 -1,80
N$12  (via drill 0.61)
  Top 0.254: v135.89,68.58 137.16,69.85 140.97,69.85 U401.8
  Bottom 0.254: R412.1 130.81,67.31 132.08,68.58 v135.89,68.58
N$13
  Top 0.254: U402.2 149.86,80.01 R414.2 R415.1
N$14
  Top 0.254: R413.1 U402.7
  Bottom 0.254: R414.1 147.32,87.63 148.59,86.36 148.59,81.28 138.43,81.28 U402.7
N$15
  Top 0.254: P401.2 P401.3 R413.2
N$16
  Bottom 0.254: R107.1 54.61,92.71 J104.1
N$17  (via drill 0.61)
  Top 0.254: P401.1 v130.81,82.55 130.81,80.01 R412.2
  Bottom 0.254: v130.81,82.55 U402.6
N$18
  Top 2: 161,80 161,101 140,101
N$19
  Bottom 0.254: R108.1 59.69,91.44 49.53,91.44 46.99,93.98 J104.3
N$20
  Top 0.254: Q101.1 R108.2
N$21
  Top 0.254: Q101.2 R109.1
N$22
  Top 0.254: R109.2 Q102.C
  Bottom 0.254: Q102.C R110.2
N$23
  Bottom 2: 20,-1 -1,-1 -1,20
N$24
  Top 0.254: D101.C R101.2 U101.2
N$25
  Top 0.254: Q102.B 72.39,87.63 72.39,80.01 R111.2
  Bottom 0.254: R102.2 63.5,76.2 R111.2
N$26
  Top 0.254: R101.1 44.45,88.9 44.45,93.98 J101.1
N$27
  Top 0.254: D101.A 40.64,90.17 J101.2
  Bottom 0.254: U101.3 50.8,85.09 45.72,85.09 D101.A
N$28  (via drill 0.61)
  Top 0.254: v66.04,36.83 U102.13
  Bottom 0.254: v66.04,36.83 67.31,35.56 X101.8
N$29
  Top 0.254: X101.1 62.23,29.21 62.23,39.37 U102.12
N$30
  Top 0.254: R112.2 U101.7
N$31  (via drill 0.61)
  Top 0.254: U501.2 C502.2 100.33,78.74 v100.33,86.36 | R501.2 P501.1
  Bottom 0.254: v100.33,86.36 83.82,86.36 R501.2
N$32
  Top 0.254: U102.30 C105.1
N$33
  Top 0.254: R501.1 93.98,88.9 93.98,91.44 95.25,92.71 102.87,92.71 102.87,83.82 107.95,78.74 U501.1
  Bottom 0.254: U501.1 C502.1
N$34
  Bottom 2: 140,-1 161,-1 161,20
N$35  (via drill 0.61)
  Top 0.254: 115.57,63.5 U501.9 | U501.8 115.57,63.5 | v113.03,80.01 113.03,66.04 115.57,63.5
  Bottom 0.254: v113.03,80.01 R511.1
N$36
  Top 0.254: U501.14 C522.1
  Bottom 0.254: R521.1 124.46,78.74 120.65,78.74 C522.1
N$37  (via drill 0.61)
  Top 0.254: U501.13 C522.2 119.38,76.2 123.19,76.2 123.19,78.74 121.92,78.74 116.84,83.82 116.84,97.79 105.41,97.79 104.14,96.52 J501.2 | v125.73,74.93 R521.2
  Bottom 0.254: C522.2 v125.73,74.93
N$38
  Top 0.254: R511.2 106.68,92.71 J501.1
N$39
  Top 0.254: U501.7 U501.6
  Bottom 0.254: R531.1 U501.7
N$40
  Top 0.254: P531.3 86.36,82.55 D531.1
  Bottom 0.254: R532.1 88.9,74.93 D531.1
N$41
  Bottom 0.254: P531.2 93.98,81.28 95.25,82.55 101.6,82.55 102.87,81.28 102.87,78.74 100.33,78.74 R534.1
N$42
  Top 0.254: R533.2 101.6,91.44 95.25,91.44 95.25,83.82 P531.1 90.17,71.12 85.09,71.12 83.82,72.39 D531.3
N$43
  Top 0.254: R531.2 R535.1 96.52,87.63 R534.2
  Bottom 0.254: U531.2 109.22,91.44 100.33,91.44 R534.2
N$44
  Top 0.254: R536.1 115.57,83.82 115.57,90.17 113.03,92.71 U531.1
  Bottom 0.254: R535.2 99.06,92.71 U531.1
N$45
  Bottom 2: 20,101 -1,101 -1,80
N$46
  Top 0.254: U531.6 R536.2 121.92,86.36 R537.1
N$47
  Bottom 2: 161,80 161,101 140,101
N$48
  Bottom 0.254: U531.7 119.38,91.44 124.46,91.44 R537.2 120.65,97.79 102.87,97.79 X2.1
N$50
  Top 0.254: J531.1 X2.3
N$51
  Top 0.254: R601.2 R602.2 R604.2 | U601.2 R603.2 38.1,15.24 R605.1
  Bottom 0.254: R604.2 R603.2
N$52
  Top 0.254: U601.1 R605.2 R606.1
N$53
  Top 0.254: R614.2 U611.2 | R614.2 R613.2 55.88,15.24 R615.1 | R614.2 R612.2 R611.2
N$54
  Top 0.254: U601.6 36.83,6.35 36.83,7.62 38.1,8.89 43.18,8.89 R607.1 C601.1 43.18,20.32 R606.2
N$55
  Top 0.254: U611.6 54.61,6.35 54.61,8.89 50.8,8.89 R617.1 C611.1 50.8,20.32 R616.2
N$56
  Top 0.254: R616.1 R615.2 57.15,11.43 57.15,8.89 62.23,8.89 U611.1
N$57
  Top 0.254: C611.2 R618.1 48.26,10.16 52.07,6.35 52.07,1.27 59.69,1.27 U611.7
N$58
  Top 0.254: U601.7 36.83,1.27 41.91,1.27 41.91,6.35 45.72,10.16 R608.1 C601.2
N$59  (via drill 0.61)
  Top 0.254: v121.92,24.13 121.92,19.05 134.62,19.05 134.62,33.02 | 134.62,33.02 U701.2 | 134.62,33.02 U701.1
  Bottom 0.254: R701.1 114.3,24.13 v121.92,24.13
N$60
  Top 0.254: R702.1 119.38,26.67 119.38,33.02 U701.7 U701.6
N$61
  Top 0.254: R621.2 R623.2 R622.2 R624.2 | R624.2 U621.2 | R625.1 77.47,20.32 R624.2
N$63
  Top 0.254: U621.1 R625.2 R626.1
N$64
  Top 0.254: R627.1 C621.1 78.74,16.51 | U621.6 78.74,6.35 78.74,16.51 | 78.74,16.51 78.74,19.05 R626.2
N$65
  Top 0.254: U621.7 78.74,1.27 83.82,1.27 83.82,6.35 87.63,10.16 R628.1 C621.2
N$66
  Top 0.254: R703.1 119.38,13.97 119.38,25.4 U701.8 U701.9
N$68
  Top 0.254: R633.2 R634.2 | R635.1 R632.2 R631.2 U631.2
  Bottom 0.254: R631.2 R633.2
N$69
  Top 0.254: R636.1 97.79,15.24 R635.2
  Bottom 0.254: U631.1 104.14,11.43 96.52,11.43 R636.1
N$70  (via drill 0.61)
  Top 0.254: v93.98,3.81 92.71,5.08 R637.1 C631.1 93.98,17.78 93.98,21.59 R636.2
  Bottom 0.254: U631.6 99.06,3.81 v93.98,3.81
N$71  (via drill 0.61)
  Top 0.254: R638.1 C631.2 | U631.7 99.06,6.35 99.06,7.62 97.79,8.89 93.98,8.89 v93.98,11.43
  Bottom 0.254: v93.98,11.43 91.44,11.43 R638.1
N$72
  Top 0.254: R704.1 133.35,25.4 U701.13
  Bottom 0.254: U701.13 U701.14
N$73
  Bottom 0.254: R701.2 115.57,10.16 121.92,10.16 J701.1
N$74
  Top 0.254: R702.2 119.38,8.89 128.27,8.89 J701.2
N$75
  Top 0.254: R703.2 132.08,8.89 J702.1
N$76
  Top 0.254: R704.2 134.62,8.89 J702.2
N$77
  Top 0.254: U711.2 U711.1
  Bottom 0.254: R711.1 134.62,24.13 152.4,24.13 152.4,34.29 U711.2
N$78  (via drill 0.61)
  Top 0.254: R712.1 137.16,24.13 v137.16,31.75
  Bottom 0.254: v137.16,31.75 139.7,34.29 U711.7 U711.6
N$79
  Top 0.254: R713.1 139.7,13.97 139.7,25.4 U711.8
  Bottom 0.254: U711.8 U711.9
N$80
  Top 0.254: U711.13 U711.14 R714.1
N$81
  Top 0.254: R711.2 138.43,7.62 J711.1
N$82
  Top 0.254: R712.2 140.97,7.62 J711.2
N$83
  Top 0.254: R713.2 144.78,8.89 J712.1
N$84
  Bottom 0.254: R714.2 149.86,6.35 J712.2
N$86
  Bottom 0.508: L202.1 6.35,87.63 13.97,87.63 17.78,91.44 20.32,91.44 22.86,93.98 J201.1
N$87
  Top 0.508: L201.1 12.7,91.44 J201.5 J201.4
N$90
  Bottom 0.254: R802.2 24.13,43.18 20.32,43.18 19.05,44.45 Q801.2
N$92
  Top 0.254: U201.3 16.51,74.93 R201.2 16.51,85.09 D201.C | C202.+ C201.1
  Bottom 0.254: C201.1 12.7,73.66 U201.3
N$95
  Bottom 0.254: R812.2 22.86,40.64 22.86,35.56 21.59,34.29 19.05,34.29 Q811.2
N$99
  Bottom 0.254: R822.2 25.4,27.94 19.05,27.94 Q821.2
N$103
  Top 0.254: R832.2 24.13,17.78 19.05,17.78 Q831.2
NOTE_0  (via drill 0.61)
  Top 0.254: U721.3 C721.1 | v127,58.42 125.73,57.15 125.73,49.53 119.38,43.18 v119.38,39.37
  Bottom 0.254: U403.9 133.35,58.42 v127,58.42 | v119.38,39.37 106.68,39.37 105.41,38.1 C721.1
NOTE_1  (via drill 0.61)
  Top 0.254: U721.5 C722.1 | U403.8 135.89,49.53 134.62,48.26 134.62,43.18 129.54,43.18 v129.54,41.91
  Bottom 0.254: v129.54,41.91 107.95,41.91 105.41,39.37 92.71,39.37 C722.1
NOTE_2  (via drill 0.61)
  Top 0.254: C723.1 87.63,24.13 91.44,24.13 U721.10 91.44,29.21 97.79,29.21 97.79,24.13 99.06,24.13 v99.06,16.51 | v142.24,58.42 142.24,39.37 138.43,35.56 v138.43,16.51
  Bottom 0.254: U403.7 138.43,58.42 v142.24,58.42 | v99.06,16.51 v138.43,16.51
NOTE_3  (via drill 0.61)
  Top 0.254: v96.52,21.59 U721.12 | U403.6 139.7,59.69 139.7,50.8 137.16,48.26 137.16,41.91 132.08,36.83 132.08,31.75 129.54,29.21 v127,29.21
  Bottom 0.254: C724.1 92.71,22.86 93.98,21.59 v96.52,21.59 109.22,21.59 111.76,24.13 113.03,24.13 118.11,29.21 v127,29.21
NOTE_A  (via drill 0.61)
  Top 0.254: v99.06,13.97 101.6,16.51 101.6,24.13 100.33,24.13 100.33,33.02 | 100.33,33.02 U721.2 | 100.33,33.02 U721.1
  Bottom 0.254: R601.1 31.75,19.05 80.01,19.05 85.09,13.97 v99.06,13.97
NOTE_B
  Top 0.254: R611.1 77.47,34.29 U721.7 U721.6
NOTE_C
  Top 0.254: R621.1 71.12,21.59 76.2,21.59 76.2,24.13 78.74,26.67 U721.8 U721.9
NOTE_D
  Top 0.254: R631.1 102.87,25.4 U721.14
  Bottom 0.254: U721.13 U721.14
NOTEOUT_A  (via drill 0.61)
  Top 0.254: R607.2 R608.2 46.99,3.81 46.99,19.05 v54.61,26.67 | J601.1 111.76,7.62 v111.76,29.21
  Bottom 0.254: v111.76,29.21 110.49,30.48 63.5,30.48 59.69,26.67 v54.61,26.67
NOTEOUT_B  (via drill 0.61)
  Top 0.254: R618.2 R617.2 | J601.2 115.57,5.08 111.76,1.27 88.9,1.27 v88.9,3.81
  Bottom 0.254: v88.9,3.81 88.9,1.27 52.07,1.27 R617.2
NOTEOUT_C  (via drill 0.61)
  Top 0.254: R627.2 R628.2 87.63,5.08 88.9,6.35 v88.9,15.24
  Bottom 0.254: J602.1 116.84,8.89 114.3,8.89 111.76,11.43 111.76,15.24 v88.9,15.24
NOTEOUT_D
  Top 0.254: R638.2 R637.2
  Bottom 0.254: J602.2 121.92,1.27 93.98,1.27 R637.2
PA0  (via drill 0.61)
  Top 0.254: U102.40 36.83,57.15 v36.83,62.23 | v100.33,64.77 100.33,54.61 101.6,53.34 U404.3
  Bottom 0.254: v36.83,62.23 39.37,64.77 v100.33,64.77
PA1  (via drill 0.61)
  Top 0.254: U102.39 39.37,54.61 v39.37,49.53 | v93.98,46.99 93.98,44.45 95.25,43.18 100.33,43.18 100.33,46.99 101.6,48.26 U404.5
  Bottom 0.254: v39.37,49.53 41.91,46.99 v93.98,46.99
PA2  (via drill 0.61)
  Top 0.254: U102.38 41.91,54.61 41.91,53.34 v50.8,44.45
  Bottom 0.254: v50.8,44.45 93.98,44.45 95.25,43.18 U404.7
PA3  (via drill 0.61)
  Top 0.254: U102.37 44.45,54.61 44.45,53.34 54.61,43.18 v54.61,38.1 | v105.41,36.83 106.68,38.1 106.68,39.37 107.95,40.64 U404.9
  Bottom 0.254: v54.61,38.1 88.9,38.1 90.17,36.83 v105.41,36.83
PA4  (via drill 0.61)
  Top 0.254: U102.36 44.45,57.15 44.45,58.42 43.18,58.42 v43.18,63.5
  Bottom 0.254: v43.18,63.5 92.71,63.5 95.25,60.96 106.68,60.96 107.95,59.69 107.95,57.15 100.33,57.15 100.33,44.45 109.22,44.45 U404.11
PA5  (via drill 0.61)
  Top 0.254: S104.8 R115.2 | U102.35 v48.26,66.04
  Bottom 0.254: v48.26,66.04 43.18,66.04 41.91,67.31 S104.8
PA6
  Top 0.254: S104.7 R115.3 44.45,74.93 50.8,74.93 U102.34
PA7
  Top 0.254: R115.4 S104.6 45.72,67.31 45.72,58.42 46.99,58.42 46.99,53.34 52.07,53.34 52.07,54.61 U102.33
PB0
  Top 0.254: S101.2 R113.2
  Bottom 0.254: U102.1 26.67,31.75 8.89,31.75 2.54,25.4 2.54,15.24 12.7,15.24 13.97,13.97 R113.2
PB1
  Top 0.254: R113.3 S101.3 16.51,2.54 27.94,2.54 34.29,8.89 34.29,13.97 36.83,16.51 36.83,39.37 U102.2
PB2
  Top 0.254: R113.4 S101.4 19.05,3.81 22.86,3.81 24.13,5.08 24.13,11.43 34.29,21.59 34.29,43.18 39.37,43.18 39.37,41.91 U102.3
PB3  (via drill 0.61)
  Top 0.254: S101.5 R113.5 25.4,16.51 25.4,27.94 v29.21,31.75
  Bottom 0.254: U102.4 43.18,31.75 v29.21,31.75
PB4
  Bottom 0.254: U102.5 45.72,45.72 R114.2 S102.1
PB5
  Top 0.254: U102.6 49.53,39.37 49.53,34.29 50.8,33.02 50.8,30.48 J102.1
PB6
  Top 0.254: U102.7 52.07,39.37 52.07,29.21 48.26,25.4 43.18,25.4 43.18,27.94 J102.4
PB7
  Bottom 0.254: U102.8 53.34,30.48 J102.3
PC0  (via drill 0.61)
  Top 0.254: v85.09,58.42 97.79,71.12 v97.79,74.93
  Bottom 0.254: U102.22 81.28,58.42 v85.09,58.42 | v97.79,74.93 99.06,76.2 110.49,76.2 113.03,78.74 119.38,78.74 120.65,80.01 132.08,80.01 133.35,78.74 133.35,74.93 142.24,74.93 144.78,72.39 144.78,57.15 135.89,57.15 134.62,58.42 134.62,64.77 U401.5
PC1  (via drill 0.61)
  Top 0.254: v96.52,59.69 99.06,62.23 v99.06,71.12 | v127,71.12 132.08,71.12 132.08,69.85 135.89,66.04 U401.6
  Bottom 0.254: U102.23 78.74,59.69 v96.52,59.69 | v99.06,71.12 v127,71.12
PC2  (via drill 0.61)
  Top 0.254: v85.09,62.23 95.25,72.39 v95.25,73.66 | v127,76.2 133.35,76.2 U401.4
  Bottom 0.254: U102.24 76.2,62.23 v85.09,62.23 | v95.25,73.66 110.49,73.66 113.03,76.2 v127,76.2
PC3  (via drill 0.61)
  Top 0.254: U102.25 74.93,57.15 74.93,71.12 78.74,74.93 v78.74,83.82 | v135.89,78.74 U401.3
  Bottom 0.254: v78.74,83.82 80.01,85.09 105.41,85.09 107.95,82.55 123.19,82.55 124.46,81.28 135.89,81.28 v135.89,78.74
PC4
  Top 0.254: R802.1 24.13,53.34 24.13,58.42 R801.1
  Bottom 0.254: U102.26 71.12,50.8 R802.1
PC5
  Top 0.254: R812.1 22.86,52.07 22.86,57.15 R811.1
  Bottom 0.254: U102.27 68.58,52.07 25.4,52.07 R812.1
PC6
  Bottom 0.254: R822.1 29.21,39.37 29.21,49.53 22.86,49.53 20.32,52.07 20.32,55.88 R821.1 24.13,58.42 66.04,58.42 U102.28
PC7
  Top 0.254: R832.1 22.86,38.1 22.86,50.8 21.59,52.07 R831.1
  Bottom 0.254: U102.29 63.5,53.34 R831.1
PD0  (via drill 0.61)
  Top 0.254: U101.6 R102.1 52.07,62.23 54.61,59.69 v54.61,49.53 | v68.58,48.26 U102.14
  Bottom 0.254: v68.58,48.26 67.31,49.53 v54.61,49.53
PD1  (via drill 0.61)
  Top 0.254: U102.15 72.39,41.91 v72.39,66.04 | v120.65,66.04 120.65,73.66 121.92,74.93 124.46,74.93 124.46,78.74 129.54,83.82 129.54,86.36 135.89,86.36 135.89,81.28 138.43,81.28 U401.2
  Bottom 0.254: v72.39,66.04 v120.65,66.04
PD2  (via drill 0.61)
  Top 0.254: U102.16 74.93,41.91 v74.93,48.26
  Bottom 0.254: v74.93,48.26 80.01,53.34 86.36,53.34 88.9,55.88 R114.6 S102.5
PD3  (via drill 0.61)
  Top 0.254: U102.17 77.47,41.91 v77.47,48.26
  Bottom 0.254: v77.47,48.26 81.28,52.07 88.9,52.07 R114.5 S102.4
PD4  (via drill 0.61)
  Top 0.254: U102.18 80.01,41.91 v80.01,48.26
  Bottom 0.254: v80.01,48.26 82.55,50.8 R114.4 S102.3
PD5
  Top 0.254: U102.19 82.55,39.37 82.55,38.1 87.63,38.1 87.63,46.99 88.9,48.26 R114.3
  Bottom 0.254: R114.3 S102.2
PD6  (via drill 0.61)
  Top 0.254: S104.5 R115.5 | U102.20 82.55,41.91 v82.55,67.31
  Bottom 0.254: v82.55,67.31 81.28,68.58 S104.5
PD7  (via drill 0.61)
  Top 0.254: U102.21 83.82,71.12 80.01,74.93 v80.01,86.36 | v59.69,88.9 55.88,92.71 J099.2
  Bottom 0.254: v80.01,86.36 77.47,88.9 v59.69,88.9
PITCH_CV  (via drill 0.61)
  Top 0.254: v100.33,17.78 R632.1 | J531.2 88.9,96.52 87.63,97.79 64.77,97.79 64.77,68.58 66.04,67.31 66.04,59.69 64.77,58.42 64.77,25.4 63.5,24.13 R612.1
  Bottom 0.254: R602.1 31.75,21.59 62.23,21.59 | 62.23,21.59 R612.1 | 73.66,21.59 R622.1 | 62.23,21.59 73.66,21.59 | v100.33,17.78 82.55,17.78 78.74,21.59 73.66,21.59
PITCH_ZERO
  Top 0.254: R604.1 30.48,25.4 R418.2 R419.2
  Bottom 0.254: 62.23,24.13 R614.1 | 62.23,24.13 76.2,24.13 | 76.2,24.13 R624.1 | R634.1 106.68,24.13 76.2,24.13 | R604.1 34.29,24.13 62.23,24.13
RESET
  Top 0.254: U102.9 R106.2
  Bottom 0.254: J102.5 48.26,38.1 52.07,38.1 52.07,43.18 54.61,43.18 55.88,41.91 U102.9
VELO_0
  Top 0.254: 151.13,36.83 C711.1 | U711.3 151.13,36.83 | U403.5 144.78,62.23 144.78,63.5 152.4,63.5 152.4,50.8 154.94,48.26 154.94,36.83 151.13,36.83
VELO_1
  Top 0.254: U711.5 C712.1 144.78,39.37 144.78,59.69 U403.4
VELO_2
  Top 0.254: C713.1 142.24,21.59 146.05,21.59 U711.10 147.32,27.94 147.32,59.69 U403.3
VELO_3
  Top 0.254: C714.1 U711.12 149.86,27.94 149.86,59.69 U403.2
WHEEL_CV  (via drill 0.61)
  Top 0.254: v35.56,20.32 R603.1 | v57.15,20.32 58.42,21.59 | 58.42,21.59 R613.1 | 71.12,24.13 R623.1 | 71.12,24.13 68.58,24.13 68.58,22.86 67.31,21.59 64.77,21.59 | 58.42,21.59 64.77,21.59 | v105.41,26.67 R633.1 | 71.12,24.13 v76.2,29.21 | P501.2 80.01,88.9 77.47,86.36 77.47,74.93 67.31,64.77 67.31,26.67 64.77,24.13 64.77,21.59
  Bottom 0.254: v35.56,20.32 v57.15,20.32 | v105.41,26.67 102.87,29.21 v76.2,29.21